# Altium project EV75E52A_R3.PrjPcb (part 2 of 4)
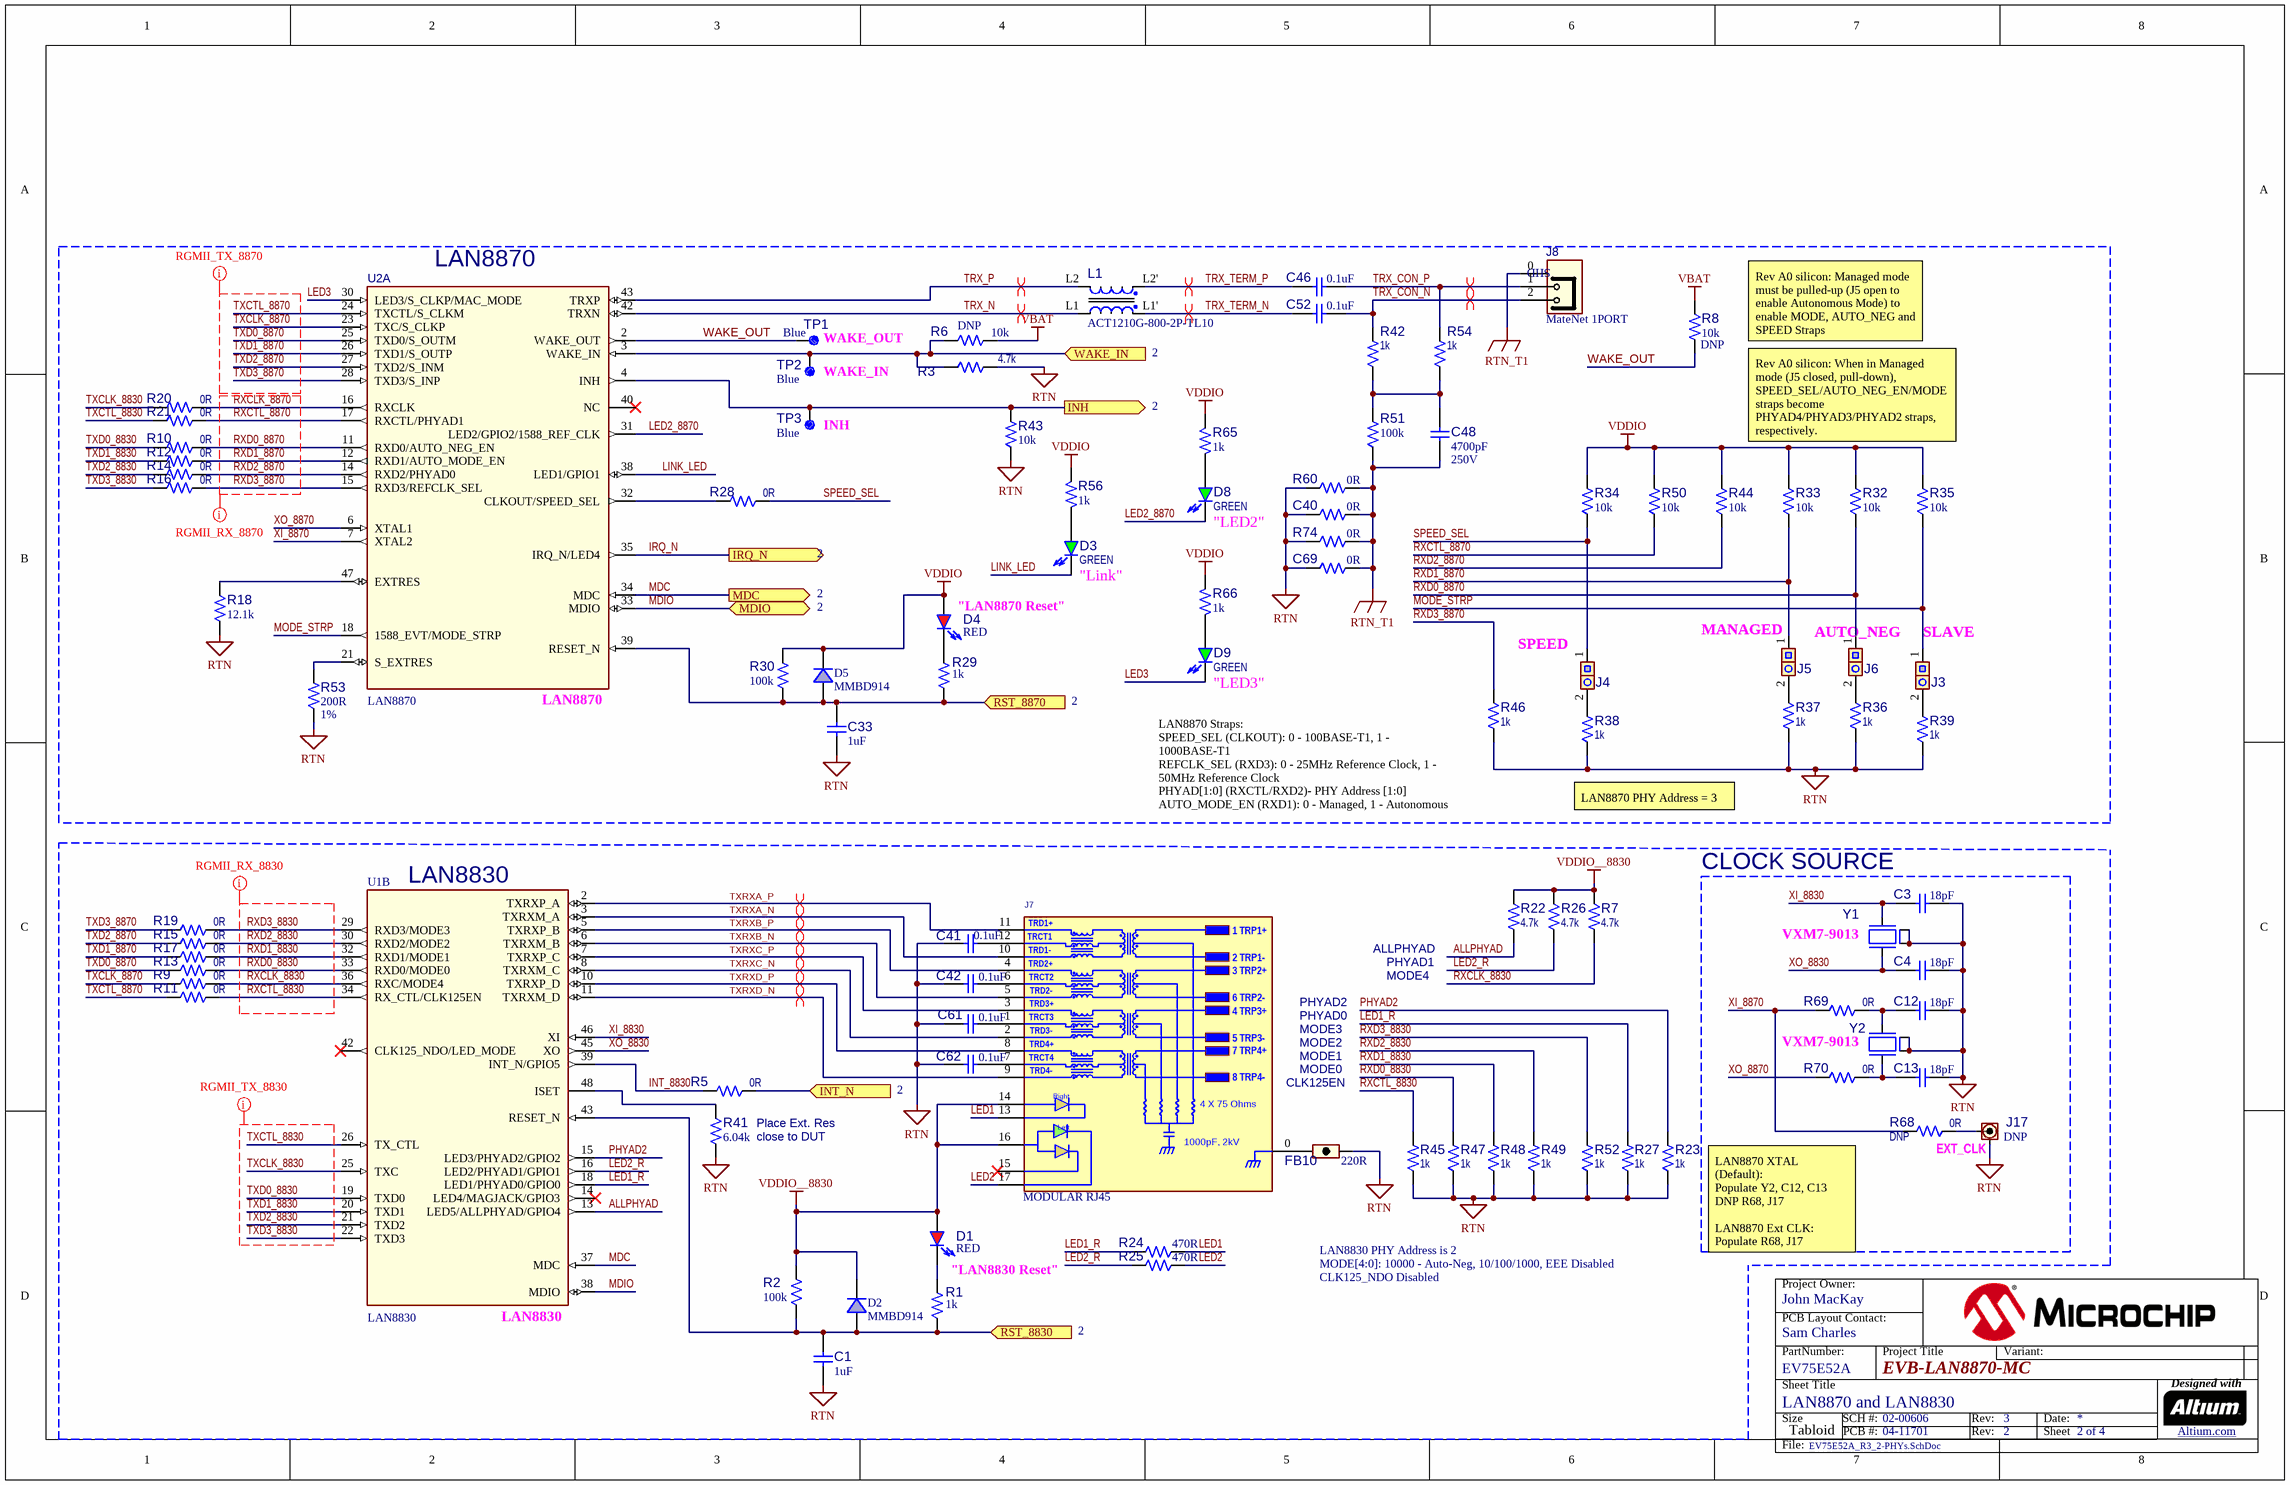
[diagram p4: EV75E52A_R3_2-PHYs.SchDoc]

## Sheet EV75E52A_R3_2-PHYs.SchDoc: LAN8870 and KSZ9131 (continued)

### Library data of the parts
C1 C33 = CAP0265: Capacitor; Manufacturer 1: AVX; Manufacturer Part Number 1: 0603YD105KAT2A; Voltage: 16V; Description_: CAP CER 1uF 16V 10% X5R SMD 0603; Dev Tools Status: Production; Tolerance: 10%; Temperature Coeffcient: X5R; Type: Ceramic; Populated: Yes; MCHP-ID: CAP0265; Value: 1uF; Package: 0603; Revision: 1; Symbol: Capacitor NP; Status: MCL Design; ComponentLink1URL: https://chn-vm-apps.microchip.com/mchprepo/parts/Datasheets/smccp.pdf; ComponentLink1Description: Datasheet; Operating Temperature: -55C to +85C; Category: Capacitor; Manufacturer 2: Murata; Manufacturer Part Number 2: GRM188R61C105KA93D; Manufacturer 3: Murata; Manufacturer Part Number 3: GRM185R61C105KE44D; Manufacturer 4: Panasonic; Manufacturer Part Number 4: ECJ-1VB1C105K; Manufacturer 5: TDK; Manufacturer Part Number 5: C1608X5R1C105K; Manufacturer 6: Taiyo Yuden; Manufacturer Part Number 6: EMK107BJ105KA-T; Supplier 1: Digi-Key; Supplier Part Number 1: 478-1249-1-ND; Supplier 2: Digi-Key; Supplier Part Number 2: 490-1536-1-ND; Supplier 3: Digi-Key; Supplier Part Number 3: 490-3894-1-ND; Supplier 4: Digi-Key; Supplier Part Number 4: PCC2224CT-ND; Supplier 5: Digi-Key; Supplier Part Number 5: 445-1416-1-ND; Supplier 6: Digi-Key; Supplier Part Number 6: 587-1251-1-ND; Quantity Override: 1
C3 C4 C12 C13 = CAP1091: Capacitor; Manufacturer 1: Murata; Manufacturer Part Number 1: GRM1555C1H180JA01D; Voltage: 50V; Description_: CAP CER 18pF 50V 5% C0G SMD 0402; Dev Tools Status: Production; Tolerance: 5%; Temperature Coeffcient: C0G; Type: Ceramic; Owner: Tad Ahlvers; Populated: YES; MCHP-ID: CAP1091; Package: 0402; Revision: 2; Symbol: Capacitor NP; Status: MCL Design; ComponentLink1URL: https://chn-vm-apps.microchip.com/mchprepo/parts/Datasheets/c02e.pdf; ComponentLink1Description: SVN Datasheet; ComponentLink2URL: C:\ALTIUM_WORK\00001_MCHP-CDB\Datasheets\c02e.pdf; ComponentLink2Description: Local Datasheet; ComponentLink3URL: C:\ALTIUM_WORK\00001_MCHP-CDB\Library\LibraryRefs\Capacitor NP.SchLib; ComponentLink3Description: Open Symbol; ComponentLink4URL: C:\ALTIUM_WORK\00001_MCHP-CDB\Library\Footprints\CAP_C_0402.PcbLib; ComponentLink4Description: Open Footprint; ComponentLink5Description: Open Footprint 2; ComponentLink6Description: Open Footprint 3; ComponentLink7Description: Open Footprint 4; Operating Temperature: -55C to +125C; Category: Capacitor; Manufacturer 2: Murata; Manufacturer Part Number 2: GRM1555C1H180JZ01; Supplier 1: Digi-Key; Supplier Part Number 1: 490-5858-1-ND; Supplier 2: Murata; Supplier Part Number 2: GRM1555C1H180JZ01; Quantity Override: 1
C40 C69 = RES2360: Manufacturer 1: Panasonic Electronic Components; Manufacturer Part Number 1: ERJ-3GEY0R00V; Description_: RES TKF 0R 1/10W SMD 0603 AEC-Q200; Dev Tools Status: Production; Type: RES SMD; Circuit Type: Isolated; Power: 1/10W; Owner: Steve Dziaba; Populated: YES; Restricted Sourcing: No; MCHP-ID: RES2360; Package: 0603; Revision: 1; Symbol: Resistor; Status: MCL Design; ComponentLink1URL: https://chn-vm-apps.microchip.com/mchprepo/parts/Datasheets/ERJ-3GEY0R00V.pdf; ComponentLink1Description: SVN Datasheet; ComponentLink2URL: C:\ALTIUM_WORK\00001_MCHP-CDB\Datasheets\ERJ-3GEY0R00V.pdf; ComponentLink2Description: Local Datasheet; ComponentLink3URL: C:\ALTIUM_WORK\00001_MCHP-CDB\Library\LibraryRefs\Resistor.SchLib; ComponentLink3Description: Open Symbol; ComponentLink4URL: C:\ALTIUM_WORK\00001_MCHP-CDB\Library\Footprints\RES_C_0603.PcbLib; ComponentLink4Description: Open Footprint; ComponentLink5Description: Open Footprint 2; ComponentLink6Description: Open Footprint 3; ComponentLink7Description: Open Footprint 4; Category: Resistor; Composition: TKF; Manufacturer 2: Vishay; Manufacturer Part Number 2: CRCW06030000Z0EB; Supplier 1: Digi-Key; Supplier Part Number 1: P0.0GCT-ND; Supplier 2: Digi-Key; Supplier Part Number 2: 541-2968-1-ND; Quantity Override: 1
C41 C42 C61 C62 = CAP1463: Capacitor; Manufacturer 1: TDK Corporation; Manufacturer Part Number 1: C1005X7R1H104K050BB; Tolerance: 10%; Description_: CAP CER 0.1uF 50V 10% X7R SMD 0402; Dev Tools Status: Production; Temperature Coeffcient: X7R; Type: Ceramic; Owner: Jamus Griego; Populated: YES; Voltage: 50V; Revision: 1; ComponentLink1URL: https://chn-vm-apps.microchip.com/mchprepo/parts/Datasheets/TDKMLCCCapRange.pdf; ComponentLink1Description: Datasheets; Operating Temperature: -55C to +125C; Category: Capacitor; Supplier 1: Digi-Key; Supplier Part Number 1: 445-5932-1-ND; MCHP-ID: CAP1463; Status: MCL Design; Quantity Override: 1; Package: 0402; Symbol: Capacitor NP
C46 C52 = CAP1682: Capacitor; Manufacturer 1: TDK Corporation; Manufacturer Part Number 1: C2012X7T2E104K125AA; Voltage: 250V; Description_: CAP CER 0.1uF 250V 10% X7T SMD 0805; Dev Tools Status: Design; Tolerance: 10%; Temperature Coeffcient: X7T; Type: Ceramic; Owner: Cristian Papuc; Populated: Yes; MCHP-ID: CAP1682; Package: 0805; Revision: A; Symbol: Capacitor NP; Status: MCL Design; ComponentLink1URL: https://chn-vm-apps.microchip.com/mchprepo/parts/Datasheets/mlcc_commercial_midvoltage_en.pdf; ComponentLink1Description: SVN Datasheet; ComponentLink2URL: C:\ALTIUM_WORK\00001_MCHP-CDB\Datasheets\mlcc_commercial_midvoltage_en.pdf; ComponentLink2Description: Local Datasheet; ComponentLink3URL: C:\ALTIUM_WORK\00001_MCHP-CDB\Library\LibraryRefs\Capacitor NP.SchLib; ComponentLink3Description: Open Symbol; ComponentLink4URL: C:\ALTIUM_WORK\00001_MCHP-CDB\Library\Footprints\CAP_C_0805.PcbLib; ComponentLink4Description: Open Footprint; ComponentLink5Description: Open Footprint 2; ComponentLink6Description: Open Footprint 3; ComponentLink7Description: Open Footprint 4; Operating Temperature: -55C to +125C; Category: Capacitor; Quantity Override: 1; Supplier 1: Digi-Key; Supplier Part Number 1: 445-C2012X7T2E104K125AACT-ND
C48 = CAP1956: Manufacturer 1: KEMET; Manufacturer Part Number 1: C0805C472KARACAUTO; Description_: CAP CER 4700pF 250V 10% X7R SMD 0805; Dev Tools Status: Production; Tolerance: 10%; Temperature Coefficient: X7R; Type: Ceramic; Owner: Darius Rydahl; Populated: YES; MCHP-ID: CAP1956; Revision: 1; Symbol: Capacitor NP; Status: MCL Design; ComponentLink1URL: https://chn-vm-apps.microchip.com/mchprepo/parts/Datasheets/2571446.pdf; ComponentLink1Description: SVN Datasheet; ComponentLink2URL: C:\ALTIUM_WORK\00001_MCHP-CDB\Datasheets\2571446.pdf; ComponentLink2Description: Local Datasheet; ComponentLink3URL: C:\ALTIUM_WORK\00001_MCHP-CDB\Library\LibraryRefs\Capacitor NP.SchLib; ComponentLink3Description: Open Symbol; ComponentLink4URL: C:\ALTIUM_WORK\00001_MCHP-CDB\Library\Footprints\CAP_C_0805.PcbLib; ComponentLink4Description: Open Footprint; ComponentLink5Description: Open Footprint 2; ComponentLink6Description: Open Footprint 3; ComponentLink7Description: Open Footprint 4; Operating Temperature: -40C to +125C; Category: Capacitor; Quantity Override: 1; Supplier 1: Digi-Key; Supplier Part Number 1: 399-16658-1-ND
D1 D4 = LED1073: LED; Manufacturer 1: Lite-On Inc.; Manufacturer Part Number 1: LTST-C191KRKT; Description_: DIO RED 2V 20mA 54mcd CLEAR SMD 0603; Dev Tools Status: Production; Type: LED Single; Forward Current: 20mA; Owner: Sompoch Loboonlert; Populated: YES; MCHP-ID: LED1073; Revision: 2; Symbol: LED_RED; Status: MCL Design; Package: 0603; ComponentLink1URL: https://chn-vm-apps.microchip.com/mchprepo/parts/Datasheets/LTST-C191KRKT.PDF; ComponentLink1Description: SVN Datasheet; ComponentLink2URL: C:\ALTIUM_WORK\00001_MCHP-CDB\Datasheets\LTST-C191KRKT.PDF; ComponentLink2Description: Local Datasheet; ComponentLink3URL: C:\ALTIUM_WORK\00001_MCHP-CDB\Library\LibraryRefs\LED_RED.SchLib; ComponentLink3Description: Open Symbol; ComponentLink4URL: C:\ALTIUM_WORK\00001_MCHP-CDB\Library\Footprints\LED_0603_RED.PcbLib; ComponentLink4Description: Open Footprint; ComponentLink5Description: Open Footprint 2; ComponentLink6Description: Open Footprint 3; ComponentLink7Description: Open Footprint 4; Category: Diode; Supplier 1: Digi-Key; Supplier Part Number 1: 160-1447-1-ND; Quantity Override: 1
D2 D5 = DIODE1281: Manufacturer 1: ON Semiconductor; Manufacturer Part Number 1: MMBD914LT1G; Description_: DIO RECT MMBD914LT1G 1V 10mA 100V SMD SOT-23-3; Dev Tools Status: Design; Type: Rectifier Single; Forward Current: 10mA; Power: 10mW; Reverse Current: 5uA; Reverse Recovery Time: 4ns; Reverse Voltage: 100V; Owner: Sam Charles; Populated: YES; MCHP-ID: DIODE1281; Value: MMBD914; Revision: B; Symbol: DIODE SINGLE sot-23-3; Status: MCL Design; Package: SOT-23-3; ComponentLink1URL: https://chn-vm-apps.microchip.com/mchprepo/parts/Datasheets/MMBD914LT1-D.PDF; ComponentLink1Description: datasheet; Operating Temperature: -55°C ~ 150°C; Category: Diode; Supplier 1: Digi-Key; Supplier Part Number 1: MMBD914LT1GOSCT-ND; Quantity Override: 1
D3 D8 D9 = DIODE1155: LED; Manufacturer 1: Lite-On Inc; Manufacturer Part Number 1: LTST-C191KGKT; Description_: DIO LED GREEN 2V 30mA 35mcd Clear SMD 0603; Dev Tools Status: Production; Type: LED Single; Forward Current: 30mA; Power: 75mW; Reverse Voltage: 5V; Owner: Tad Ahlvers; Populated: YES; MCHP-ID: DIODE1155; Revision: 1; Symbol: LED_green; Status: MCL Design; ComponentLink1URL: https://chn-vm-apps.microchip.com/mchprepo/parts/Datasheets/S_110_LTST-C191KGKT.pdf; ComponentLink1Description: SVN Datasheet; ComponentLink2URL: C:\ALTIUM_WORK\00001_MCHP-CDB\Datasheets\S_110_LTST-C191KGKT.pdf; ComponentLink2Description: Local Datasheet; ComponentLink3URL: C:\ALTIUM_WORK\00001_MCHP-CDB\Library\LibraryRefs\LED_green.SchLib; ComponentLink3Description: Open Symbol; ComponentLink4URL: C:\ALTIUM_WORK\00001_MCHP-CDB\Library\Footprints\LED_0603_GREEN.PcbLib; ComponentLink4Description: Open Footprint; ComponentLink5Description: Open Footprint 2; ComponentLink6Description: Open Footprint 3; ComponentLink7Description: Open Footprint 4; Operating Temperature: -55C to +85C; Category: Diode; Manufacturer 2: Ledtech; Manufacturer Part Number 2: LT8A23-54-SB96-T5; Supplier 1: Digi-Key; Supplier Part Number 1: 160-1446-1-ND; Supplier 2: Raynen; Supplier Part Number 2: LEDD00036B01; Quantity Override: 1
FB10 = IND1312: FERRITE 180R 1.5A SMD 0603; Manufacturer 1: Murata Electronics North America; Manufacturer Part Number 1: BLM18EG221SN1D; Description_: FERRITE 220R@100MHZ 2A SMD 0603; Dev Tools Status: Design; Owner: Sam Charles; DCR: 0.050R; Test Frequency: 100Mhz; Populated: Yes; MCHP-ID: IND1312; Revision: A; Symbol: Ferrite Bead; Status: MCL Design; ComponentLink1URL: https://chn-vm-apps.microchip.com/mchprepo/parts/Datasheets/L0110S0101BLM18E.pdf; ComponentLink1Description: SVN Datasheet; ComponentLink2URL: C:\ALTIUM_WORK\00001_MCHP-CDB\Datasheets\L0110S0101BLM18E.pdf; ComponentLink2Description: Local Datasheet; ComponentLink3URL: C:\ALTIUM_WORK\00001_MCHP-CDB\Library\LibraryRefs\Ferrite Bead.SchLib; ComponentLink3Description: Open Symbol; ComponentLink4URL: C:\ALTIUM_WORK\00001_MCHP-CDB\Library\Footprints\IND_C_0603.PcbLib; ComponentLink4Description: Open Footprint; ComponentLink5Description: Open Footprint 2; ComponentLink6Description: Open Footprint 3; ComponentLink7Description: Open Footprint 4; Operating Temperature: -55°C ~ 125°C; Package: 0603; Type: Ferrite Bead; Category: Inductor; Manufacturer 2: MOUSER ELECTRONICS; Manufacturer Part Number 2: 81-BLM18EG221SN1D; Quantity Override: 1; Supplier 1: Mouser; Supplier Part Number 1: 81-BLM18EG221SN1D
J3-J6 = CON1108: Manufacturer 1: FCI; Manufacturer Part Number 1: 77311-118-02LF; Description_: CON HDR-2.54 Male 1x2 Gold 5.84MH TH VERT; Dev Tools Status: Production; Owner: Bogdan P (M91398); Populated: Yes; MCHP-ID: CON1108; Revision: 1; Symbol: Header 1x2; Status: MCL Design; ComponentLink1URL: https://chn-vm-apps.microchip.com/mchprepo/parts/Datasheets/77311.pdf; ComponentLink1Description: SVN Datasheet; ComponentLink2URL: C:\ALTIUM_WORK\00001_MCHP-CDB\Datasheets\77311.pdf; ComponentLink2Description: Local Datasheet; ComponentLink3URL: C:\ALTIUM_WORK\00001_MCHP-CDB\Library\LibraryRefs\Header 1x2.SchLib; ComponentLink3Description: Open Symbol; ComponentLink4URL: C:\ALTIUM_WORK\00001_MCHP-CDB\Library\Footprints\HDR_M_2.54_1x2.PcbLib; ComponentLink4Description: Open Footprint; ComponentLink5Description: Open Footprint 2; ComponentLink6Description: Open Footprint 3; ComponentLink7Description: Open Footprint 4; Type: Header 2.54mm; Category: Connector; Manufacturer 2: FCI; Manufacturer Part Number 2: 68001-202HLF; Manufacturer 3: FCI; Manufacturer Part Number 3: 68000-202HLF; Manufacturer 4: Samtec; Manufacturer Part Number 4: TSW-102-07-G-S; Manufacturer 5: Sullins; Manufacturer Part Number 5: PBC02SAAN; Manufacturer 6: SPC Technology; Manufacturer Part Number 6: SPC20481; Manufacturer 7: Samtec; Manufacturer Part Number 7: TSW-102-07-F-S; Manufacturer 8: Nextron; Manufacturer Part Number 8: R-211-0211-0021-000; Manufacturer 9: Samtec; Manufacturer Part Number 9: TSW-102-07-S-S; Supplier 1: Digi-Key; Supplier Part Number 1: 609-4434-ND; Supplier 2: Digi-Key; Supplier Part Number 2: 609-3469-ND; Supplier 3: Digi-Key; Supplier Part Number 3: 609-3502-ND; Supplier 4: Digi-Key; Supplier Part Number 4: SAM1029-02-ND; Supplier 5: Digi-Key; Supplier Part Number 5: S1011E-02-ND; Supplier 6: Newark; Supplier Part Number 6: 93K5734; Supplier 7: Newark; Supplier Part Number 7: 79P3146; Supplier 8: Raynen; Supplier Part Number 8: R-211-0211-0021-000; Supplier 9: Samtec; Supplier Part Number 9: TSW-102-07-S-S; Quantity Override: 1
J7 = CON2551: Manufacturer 1: Bel Fuse; Description_: CON MODULAR JACK RJ45 10/100/1000 MAGNETICS 2xLEDs SHIELD TH; Dev Tools Status: Design; Owner: Sam Charles; Populated: YES; Revision: 1; ComponentLink5Description: Open Footprint 2; ComponentLink6Description: Open Footprint 3; ComponentLink7Description: Open Footprint 4; MCHP-ID: CON2551; Symbol: CON_RJ-45_L829-1J1T-43; Status: MCL Design; ComponentLink1URL: https://chn-vm-apps.microchip.com/mchprepo/parts/Datasheets/dr-MAG-L829-1J1T-43.pdf; ComponentLink1Description: SVN Datasheet; ComponentLink2URL: C:\ALTIUM_WORK\00001_MCHP-CDB\Datasheets\dr-MAG-L829-1J1T-43.pdf; ComponentLink2Description: Local Datasheet; ComponentLink3URL: C:\ALTIUM_WORK\00001_MCHP-CDB\Library\LibraryRefs\CON_RJ-45_L829-1J1T-43.SchLib; ComponentLink3Description: Open Symbol; ComponentLink4URL: C:\ALTIUM_WORK\00001_MCHP-CDB\Library\Footprints\CON_JACK_RJ45_L829-1J1T-43.PcbLib; ComponentLink4Description: Open Footprint; Type: Modular; Category: Connector; Manufacturer Part Number 1: L829-1J1T-43; Supplier 1: Digi-Key; Supplier Part Number 1: 380-1110-ND; Quantity Override: 1; Operating Temperature: 0°C ~ 70°C; Assembly Type: TH
J8 = CON2446: Manufacturer 1: TE Connectivity; Manufacturer Part Number 1: 9-2304372-9; Description_: CON HDR-1.8 MALE 1X2 TIN SHROUD 7MH TH R/A; Dev Tools Status: Design; Owner: Sam Charles; Populated: YES; Restricted Sourcing: No; MCHP-ID: CON2446; Revision: 2; Symbol: 3PIN_WSHD; Status: MCL Design; ComponentLink1URL: https://chn-vm-apps.microchip.com/mchprepo/parts/Datasheets/2304372_A5-2256541.pdf; ComponentLink1Description: SVN Datasheet; ComponentLink2URL: C:\ALTIUM_WORK\00001_MCHP-CDB\Datasheets\2304372_A5-2256541.pdf; ComponentLink2Description: Local Datasheet; ComponentLink3URL: C:\ALTIUM_WORK\00001_MCHP-CDB\Library\LibraryRefs\3PIN_WSHD.SchLib; ComponentLink3Description: Open Symbol; ComponentLink4URL: C:\ALTIUM_WORK\00001_MCHP-CDB\Library\Footprints\CON_2304372-9.PcbLib; ComponentLink4Description: Open Footprint; ComponentLink5Description: Open Footprint 2; ComponentLink6Description: Open Footprint 3; ComponentLink7Description: Open Footprint 4; Type: Header; Category: Connector; Supplier 1: Mouser; Supplier Part Number 1: 571-9-2304372-9; Quantity Override: 1; Operating Temperature: .-40°C to +105°C; Assembly Type: TH
J17 = CON1680: CON Jack 2 Pins; Manufacturer 1: Cinch Connectivity Solutions Johnson; Manufacturer Part Number 1: 135-3701-211; Description_: CON RF Coaxial MMCX Female 2P TH VERT; Dev Tools Status: Design; Owner: Sam Charles; MCHP-ID: CON1680; Value: RF MMCX Female; Revision: B; Symbol: CON Jack 2 Pins; Status: MCL Design; ComponentLink1URL: https://chn-vm-apps.microchip.com/mchprepo/parts/Datasheets/pi-135-3701-211.pdf; ComponentLink1Description: SVN Datasheet; ComponentLink2URL: C:\ALTIUM_WORK\00001_MCHP-CDB\Datasheets\pi-135-3701-211.pdf; ComponentLink2Description: Local Datasheet; ComponentLink3URL: C:\ALTIUM_WORK\00001_MCHP-CDB\Library\LibraryRefs\CON Jack 2 Pins.SchLib; ComponentLink3Description: Open Symbol; ComponentLink4URL: C:\ALTIUM_WORK\00001_MCHP-CDB\Library\Footprints\CON_MMCX_CINCH_135-3701-211.PcbLib; ComponentLink4Description: Open Footprint; ComponentLink5Description: Open Footprint 2; ComponentLink6Description: Open Footprint 3; ComponentLink7Description: Open Footprint 4; Type: RF; Category: Connector; Supplier 1: Digi-Key; Supplier Part Number 1: J598-ND; Quantity Override: 1
L1 = IND1916: Inductor; Manufacturer 1: TDK Corporation; Value: CM CHOKE 80uH; Description_: CM CHOKE 2.4R@100kHZ 80uH SMD 3.2X2.5MM AEC-Q200; Dev Tools Status: Design; Type: CM Choke; Owner: Sam Charles; DCR: 2.4R; Saturation Current: 70mA; Test Frequency: 100kHZ; Populated: YES; MCHP-ID: IND1916; Revision: 1; Symbol: Inductor Choke; Status: MCL Design; ComponentLink1URL: https://chn-vm-apps.microchip.com/mchprepo/parts/Datasheets/ACT1210G_Type_DS.pdf; ComponentLink1Description: SVN Datasheet; ComponentLink2URL: C:\ALTIUM_WORK\00001_MCHP-CDB\Datasheets\ACT1210G_Type_DS.pdf; ComponentLink2Description: Local Datasheet; ComponentLink3URL: C:\ALTIUM_WORK\00001_MCHP-CDB\Library\LibraryRefs\Inductor Choke.SchLib; ComponentLink3Description: Open Symbol; ComponentLink4URL: C:\ALTIUM_WORK\00001_MCHP-CDB\Library\Footprints\IND_TDK_ACT1210L-201-2P_L3.9W2.5H2.5.PcbLib; ComponentLink4Description: Open Footprint; ComponentLink5Description: Open Footprint 2; ComponentLink6Description: Open Footprint 3; ComponentLink7Description: Open Footprint 4; Operating Temperature: -40°C ~ 125°C; Package: 4 PC SMD; Category: Inductor; Supplier 1: Digi-Key; Supplier Part Number 1: 445-ACT1210G-800-2P-TL10CT-ND; Quantity Override: 1
R1 R29 = RES1128: Resistor; Manufacturer 1: Panasonic; Manufacturer Part Number 1: ERJ-3GEYJ102V; Tolerance: 5%; Description_: RES TKF 1k 5% 1/10W SMD 0603; Dev Tools Status: Production; Voltage: 75V; Temperature Coeffcient: 200ppm/C; Power: 1/10W; Owner: Bogdan P (M91398); Populated: Yes; MCHP-ID: RES1128; Value: 1k; Package: 0603; Revision: 0; Symbol: Resistor; Status: MCL Design; ComponentLink1URL: https://chn-vm-apps.microchip.com/mchprepo/parts/Datasheets/AOA0000CE1.pdf; ComponentLink1Description: SVN Datasheet; ComponentLink2URL: C:\ALTIUM_WORK\00001_MCHP-CDB\Datasheets\AOA0000CE1.pdf; ComponentLink2Description: Local Datasheet; ComponentLink3URL: C:\ALTIUM_WORK\00001_MCHP-CDB\Library\LibraryRefs\Resistor.SchLib; ComponentLink3Description: Open Symbol; ComponentLink4URL: C:\ALTIUM_WORK\00001_MCHP-CDB\Library\Footprints\RES_C_0603.PcbLib; ComponentLink4Description: Open Footprint; ComponentLink5Description: Open Footprint 2; ComponentLink6Description: Open Footprint 3; ComponentLink7Description: Open Footprint 4; Operating Temperature: -55C to +155C; Category: Resistor; Type: RES SMD; Composition: TKF; Supplier 1: Digi-Key; Supplier Part Number 1: P1.0KGCT-ND; Quantity Override: 1
R2 R30 = RSMT0215: Resistor; Manufacturer 1: Stackpole Electronics Inc; Manufacturer Part Number 1: RMCF0603FT100K; Tolerance: 1%; Description_: RES TKF 100k 1% 1/10W SMD 0603; Dev Tools Status: Production; Voltage: 75V; Temperature Coeffcient: 100ppm/C; Power: 1/10W; Populated: Yes; MCHP-ID: RSMT0215; Value: 100k; Package: 0603; Revision: 1; Symbol: Resistor; Status: MCL Design; ComponentLink1URL: https://chn-vm-apps.microchip.com/mchprepo/parts/Datasheets/AOA0000CE2.pdf; ComponentLink1Description: Datasheet; Operating Temperature: -55C to +155C; Category: Resistor; Type: RES SMD; Composition: TKF; Manufacturer 2: Panasonic; Manufacturer Part Number 2: ERJ-3EKF1003V; Manufacturer 3: Rohm Semiconductor; Manufacturer Part Number 3: MCR03EZPFX1003; Manufacturer 4: TE Connectivity; Manufacturer Part Number 4: 1622827-1; Supplier 3: Digi-Key; Supplier Part Number 3: P100KHTR-ND; Supplier 2: Digi-Key; Supplier Part Number 2: P100KHCT-ND; Supplier 1: Digi-Key; Supplier Part Number 1: RMCF0603FT100KCT-ND; Supplier 4: Digi-Key; Supplier Part Number 4: RMCF1/16100KFRTR-ND; Supplier 5: Digi-Key; Supplier Part Number 5: RHM100KHCT-ND; Supplier 6: Digi-Key; Supplier Part Number 6: A106046CT-ND; Quantity Override: 1
R3 R7 = RES1813: Manufacturer 1: Yageo; Manufacturer Part Number 1: RC0402FR-074K7L; Tolerance: 1%; Description_: RES TKF 4.7k 1% 1/16W SMD 0402; Dev Tools Status: Production; Temperature Coeffcient: 100ppm/C; Circuit Type: Isolated; Power: 1/16W; Owner: Mike Ragsdale; Populated: Yes; MCHP-ID: RES1813; Package: 0402; Revision: 1; Symbol: resistor; Status: MCL Design; ComponentLink1URL: https://chn-vm-apps.microchip.com/mchprepo/parts/Datasheets/PYu-RC_Group_51_RoHS_L_8.pdf; ComponentLink1Description: SVN Datasheet; ComponentLink2URL: C:\ALTIUM_WORK\00001_MCHP-CDB\Datasheets\PYu-RC_Group_51_RoHS_L_8.pdf; ComponentLink2Description: Local Datasheet; ComponentLink3URL: C:\ALTIUM_WORK\00001_MCHP-CDB\Library\LibraryRefs\resistor.SchLib; ComponentLink3Description: Open Symbol; ComponentLink4URL: C:\ALTIUM_WORK\00001_MCHP-CDB\Library\Footprints\RES_C_0402.PcbLib; ComponentLink4Description: Open Footprint; ComponentLink5Description: Open Footprint 2; ComponentLink6Description: Open Footprint 3; ComponentLink7Description: Open Footprint 4; Operating Temperature: -55C to +155C; Category: Resistor; Type: RES SMD; Supplier 1: Digi-Key; Supplier Part Number 1: 311-4.7KLRTR-ND; Supplier 2: Digi-Key; Supplier Part Number 2: 311-4.7KLRCT-ND; Quantity Override: 1
R5 R9-R17 R19-R21 R28 R69 R70 = RSMT1040: Manufacturer 1: Yageo; Manufacturer Part Number 1: RC0402JR-070RL; Description_: RES TKF 0R 1/16W SMD 0402; Dev Tools Status: Production; Power: 1/16W; Owner: Sompoch Loboonlert; Populated: Yes; MCHP-ID: RSMT1040; Revision: 2; Symbol: Resistor; Status: MCL Design; ComponentLink1URL: https://chn-vm-apps.microchip.com/mchprepo/parts/Datasheets/PYu-RC0402_51_RoHS_L_6.pdf; ComponentLink1Description: SVN Datasheet; ComponentLink2URL: C:\ALTIUM_WORK\00001_MCHP-CDB\Datasheets\PYu-RC0402_51_RoHS_L_6.pdf; ComponentLink2Description: Local Datasheet; ComponentLink3URL: C:\ALTIUM_WORK\00001_MCHP-CDB\Library\LibraryRefs\Resistor.SchLib; ComponentLink3Description: Open Symbol; ComponentLink4URL: C:\ALTIUM_WORK\00001_MCHP-CDB\Library\Footprints\RES_C_0402.PcbLib; ComponentLink4Description: Open Footprint; ComponentLink5Description: Open Footprint 2; ComponentLink6Description: Open Footprint 3; ComponentLink7Description: Open Footprint 4; Operating Temperature: -55C to +155C; Category: Resistor; Type: RES SMD; Composition: TKF; Supplier 1: Digi-Key; Supplier Part Number 1: 311-0.0JRCT-ND; Quantity Override: 1
R6 R8 = RES2543: Manufacturer 1: TE Connectivity Passive Product; Manufacturer Part Number 1: CRG0402F10K; Tolerance: 1%; Description_: RES TKF 10k 1% 1/16W SMD 0402; Dev Tools Status: Production; Voltage: 50V; Temperature Coefficient: 100ppm/C; Power: 1/16W; Owner: Jose Garcia; MCHP-ID: RES2543; Package: 0402; Revision: 1; Symbol: Resistor; Status: MCL Design; ComponentLink1URL: https://chn-vm-apps.microchip.com/mchprepo/parts/Datasheets/ENG_DS_1773204_J.pdf; ComponentLink1Description: SVN Datasheet; ComponentLink2URL: C:\ALTIUM_WORK\00001_MCHP-CDB\Datasheets\ENG_DS_1773204_J.pdf; ComponentLink2Description: Local Datasheet; ComponentLink3URL: C:\ALTIUM_WORK\00001_MCHP-CDB\Library\LibraryRefs\Resistor.SchLib; ComponentLink3Description: Open Symbol; ComponentLink4URL: C:\ALTIUM_WORK\00001_MCHP-CDB\Library\Footprints\RES_C_0402.PcbLib; ComponentLink4Description: Open Footprint; ComponentLink5Description: Open Footprint 2; ComponentLink6Description: Open Footprint 3; ComponentLink7Description: Open Footprint 4; Operating Temperature: -55C to 155C; Category: Resistor; Type: RES SMD; Composition: TKF; Supplier 1: Digi-Key; Supplier Part Number 1: A121528CT-ND; Quantity Override: 1
R18 = RES1490: Manufacturer 1: Vishay; Manufacturer Part Number 1: CRCW040212K1FKEDC; Tolerance: 1%; Description_: RES TKF 12.1k 1% 1/16W SMD 0402; Dev Tools Status: Production; Voltage: 50V; Power: 1/16W; Owner: Mike Ragsdale; Populated: YES; MCHP-ID: RES1490; Package: 0402; Revision: 2; Symbol: Resistor; Status: MCL Design; ComponentLink1URL: https://chn-vm-apps.microchip.com/mchprepo/parts/Datasheets/mcr_g.pdf; ComponentLink1Description: SVN Datasheet; ComponentLink2URL: C:\ALTIUM_WORK\00001_MCHP-CDB\Datasheets\mcr_g.pdf; ComponentLink2Description: Local Datasheet; ComponentLink3URL: C:\ALTIUM_WORK\00001_MCHP-CDB\Library\LibraryRefs\Resistor.SchLib; ComponentLink3Description: Open Symbol; ComponentLink4URL: C:\ALTIUM_WORK\00001_MCHP-CDB\Library\Footprints\RES_C_0402.PcbLib; ComponentLink4Description: Open Footprint; ComponentLink5Description: Open Footprint 2; ComponentLink6Description: Open Footprint 3; ComponentLink7Description: Open Footprint 4; Operating Temperature: -55C to +155C; Category: Resistor; Type: RES SMD; Composition: TKF; Manufacturer 2: Yageo; Manufacturer Part Number 2: RC0402FR-0712K1L; Supplier 1: Digi-Key; Supplier Part Number 1: 541-4703-1-ND; Supplier 2: Digi-Key; Supplier Part Number 2: 311-12.1KLRCT-ND; Quantity Override: 1
R22 R26 = RES1813: Manufacturer 1: Yageo; Manufacturer Part Number 1: RC0402FR-074K7L; Tolerance: 1%; Description_: RES TKF 4.7k 1% 1/16W SMD 0402; Dev Tools Status: Production; Temperature Coeffcient: 100ppm/C; Circuit Type: Isolated; Power: 1/16W; Owner: Mike Ragsdale; Populated: YES; MCHP-ID: RES1813; Package: 0402; Revision: 1; Symbol: resistor; Status: MCL Design; ComponentLink1URL: https://chn-vm-apps.microchip.com/mchprepo/parts/Datasheets/PYu-RC_Group_51_RoHS_L_8.pdf; ComponentLink1Description: SVN Datasheet; ComponentLink2URL: C:\ALTIUM_WORK\00001_MCHP-CDB\Datasheets\PYu-RC_Group_51_RoHS_L_8.pdf; ComponentLink2Description: Local Datasheet; ComponentLink3URL: C:\ALTIUM_WORK\00001_MCHP-CDB\Library\LibraryRefs\resistor.SchLib; ComponentLink3Description: Open Symbol; ComponentLink4URL: C:\ALTIUM_WORK\00001_MCHP-CDB\Library\Footprints\RES_C_0402.PcbLib; ComponentLink4Description: Open Footprint; ComponentLink5Description: Open Footprint 2; ComponentLink6Description: Open Footprint 3; ComponentLink7Description: Open Footprint 4; Operating Temperature: -55C to +155C; Category: Resistor; Type: RES SMD; Supplier 1: Digi-Key; Supplier Part Number 1: 311-4.7KLRTR-ND; Supplier 2: Digi-Key; Supplier Part Number 2: 311-4.7KLRCT-ND; Quantity Override: 1
R23 R27 R36-R39 R45-R49 R52 = RES1663: Manufacturer 1: Yageo; Manufacturer Part Number 1: RT0402BRD071KL; Tolerance: 0.1%; Description_: RES TF 1k 0.1% 1/16W SMD 0402; Dev Tools Status: Design; Voltage: 50V; Temperature Coeffcient: 25ppm/C; Power: 1/16W; Owner: Jose Garcia; Populated: Yes; MCHP-ID: RES1663; Package: 0402; Revision: A; Symbol: Resistor; Status: MCL Design; ComponentLink1URL: https://chn-vm-apps.microchip.com/mchprepo/parts/Datasheets/PYu-RT_1-to-0.01_RoHS_L_8.pdf; ComponentLink1Description: SVN Datasheet; ComponentLink2URL: C:\ALTIUM_WORK\00001_MCHP-CDB\Datasheets\PYu-RT_1-to-0.01_RoHS_L_8.pdf; ComponentLink2Description: Local Datasheet; ComponentLink3URL: C:\ALTIUM_WORK\00001_MCHP-CDB\Library\LibraryRefs\Resistor.SchLib; ComponentLink3Description: Open Symbol; ComponentLink4URL: C:\ALTIUM_WORK\00001_MCHP-CDB\Library\Footprints\RES_C_0402.PcbLib; ComponentLink4Description: Open Footprint; ComponentLink5Description: Open Footprint 2; ComponentLink6Description: Open Footprint 3; ComponentLink7Description: Open Footprint 4; Operating Temperature: -55C to +155C; Category: Resistor; Type: RES SMD; Composition: TF; Supplier 1: Digi-Key; Supplier Part Number 1: YAG1386CT-ND; Quantity Override: 1
R24 R25 = RSMT0337: Manufacturer 1: Panasonic; Manufacturer Part Number 1: ERJ-2GEJ471X; Tolerance: 5%; Description_: RES TKF 470R 5% 1/16W SMD 0402; Dev Tools Status: Production; Voltage: 50V; Temperature Coefficient: 200ppm/C; Power: 1/16W; Populated: Yes; MCHP-ID: RSMT0337; Package: 0402; Revision: 1; Symbol: Resistor; Status: MCL Design; ComponentLink1URL: https://chn-vm-apps.microchip.com/mchprepo/parts/Datasheets/mcr_a.pdf; ComponentLink1Description: SVN Datasheet; ComponentLink2URL: C:\ALTIUM_WORK\00001_MCHP-CDB\Datasheets\mcr_a.pdf; ComponentLink2Description: Local Datasheet; ComponentLink3URL: C:\ALTIUM_WORK\00001_MCHP-CDB\Library\LibraryRefs\Resistor.SchLib; ComponentLink3Description: Open Symbol; ComponentLink4URL: C:\ALTIUM_WORK\00001_MCHP-CDB\Library\Footprints\RES_C_0402.PcbLib; ComponentLink4Description: Open Footprint; ComponentLink5Description: Open Footprint 2; ComponentLink6Description: Open Footprint 3; ComponentLink7Description: Open Footprint 4; Operating Temperature: -55C to +155C; Category: Resistor; Type: RES SMD; Composition: TKF; Manufacturer 2: ROHM; Manufacturer Part Number 2: MCR01MZPJ471; Supplier 1: Digi-Key; Supplier Part Number 1: P470JCT-ND; Supplier 2: Digi-Key; Supplier Part Number 2: RHM470JCT-ND; Quantity Override: 1
R32-R35 R43 R44 R50 = RES2543: Manufacturer 1: TE Connectivity Passive Product; Manufacturer Part Number 1: CRG0402F10K; Tolerance: 1%; Description_: RES TKF 10k 1% 1/16W SMD 0402; Dev Tools Status: Production; Voltage: 50V; Temperature Coefficient: 100ppm/C; Power: 1/16W; Owner: Jose Garcia; Populated: YES; MCHP-ID: RES2543; Package: 0402; Revision: 1; Symbol: Resistor; Status: MCL Design; ComponentLink1URL: https://chn-vm-apps.microchip.com/mchprepo/parts/Datasheets/ENG_DS_1773204_J.pdf; ComponentLink1Description: SVN Datasheet; ComponentLink2URL: C:\ALTIUM_WORK\00001_MCHP-CDB\Datasheets\ENG_DS_1773204_J.pdf; ComponentLink2Description: Local Datasheet; ComponentLink3URL: C:\ALTIUM_WORK\00001_MCHP-CDB\Library\LibraryRefs\Resistor.SchLib; ComponentLink3Description: Open Symbol; ComponentLink4URL: C:\ALTIUM_WORK\00001_MCHP-CDB\Library\Footprints\RES_C_0402.PcbLib; ComponentLink4Description: Open Footprint; ComponentLink5Description: Open Footprint 2; ComponentLink6Description: Open Footprint 3; ComponentLink7Description: Open Footprint 4; Operating Temperature: -55C to 155C; Category: Resistor; Type: RES SMD; Composition: TKF; Supplier 1: Digi-Key; Supplier Part Number 1: A121528CT-ND; Quantity Override: 1
R41 = RES1495: Manufacturer 1: Yageo; Manufacturer Part Number 1: RC0402FR-076K04L; Tolerance: 1%; Description_: RES TKF 6.04k 1% 1/16W SMD 0402; Dev Tools Status: Production; Voltage: 50V; Power: 1/16W; Owner: Severino Balong Jr.; Populated: YES; MCHP-ID: RES1495; Package: 0402; Revision: 2; Symbol: Resistor; Status: MCL Design; ComponentLink1URL: https://chn-vm-apps.microchip.com/mchprepo/parts/Datasheets/PYu-RC_Group_51_RoHS_L_11.pdf; ComponentLink1Description: SVN Datasheet; ComponentLink2URL: C:\ALTIUM_WORK\00001_MCHP-CDB\Datasheets\PYu-RC_Group_51_RoHS_L_11.pdf; ComponentLink2Description: Local Datasheet; ComponentLink3URL: C:\ALTIUM_WORK\00001_MCHP-CDB\Library\LibraryRefs\Resistor.SchLib; ComponentLink3Description: Open Symbol; ComponentLink4URL: C:\ALTIUM_WORK\00001_MCHP-CDB\Library\Footprints\RES_C_0402.PcbLib; ComponentLink4Description: Open Footprint; ComponentLink5Description: Open Footprint 2; ComponentLink6Description: Open Footprint 3; ComponentLink7Description: Open Footprint 4; Operating Temperature: -55C to +155C; Category: Resistor; Type: RES SMD; Composition: TKF; Supplier 1: Digi-Key; Supplier Part Number 1: YAG2293TR-ND; Quantity Override: 1
R42 R54 = RES1727: Manufacturer 1: Stackpole Electronics Inc.; Manufacturer Part Number 1: RNCP1206FTD1K00; Tolerance: 1%; Description_: RES TF 1k 1% 1/2W SMD 1206; Dev Tools Status: Design; Voltage: 200V; Temperature Coeffcient: 100ppm/C; Circuit Type: Isolated; Power: 1/2W; Owner: Mark Loper; Populated: Yes; MCHP-ID: RES1727; Package: 1206; Revision: A; Symbol: Resistor; Status: MCL Design; ComponentLink1URL: https://chn-vm-apps.microchip.com/mchprepo/parts/Datasheets/SEI-rncp.pdf; ComponentLink1Description: SVN Datasheet; ComponentLink2URL: C:\ALTIUM_WORK\00001_MCHP-CDB\Datasheets\SEI-rncp.pdf; ComponentLink2Description: Local Datasheet; ComponentLink3URL: C:\ALTIUM_WORK\00001_MCHP-CDB\Library\LibraryRefs\Resistor.SchLib; ComponentLink3Description: Open Symbol; ComponentLink4URL: C:\ALTIUM_WORK\00001_MCHP-CDB\Library\Footprints\RES_C_1206.PcbLib; ComponentLink4Description: Open Footprint; ComponentLink5Description: Open Footprint 2; ComponentLink6Description: Open Footprint 3; ComponentLink7Description: Open Footprint 4; Operating Temperature: -55C to +155C; Category: Resistor; Type: RES SMD; Composition: TF; Supplier 1: Digi-Key; Supplier Part Number 1: RNCP1206FTD1K00CT-ND; Quantity Override: 1
R51 = RSMT0714: Manufacturer 1: Vishay; Manufacturer Part Number 1: CRCW0603100KFKEAHP; Tolerance: 1%; Description_: RES TKF 100k 1% 1/4W SMD 0603; Dev Tools Status: Production; Voltage: 75V; Temperature Coeffcient: 100ppm/C; Power: 1/4W; Populated: Yes; MCHP-ID: RSMT0714; Package: 0603; Revision: 1; Symbol: Resistor; Status: MCL Design; ComponentLink1URL: https://chn-vm-apps.microchip.com/mchprepo/parts/Datasheets/dcrcwe3.pdf; ComponentLink1Description: SVN Datasheet; ComponentLink2URL: C:\ALTIUM_WORK\00001_MCHP-CDB\Datasheets\dcrcwe3.pdf; ComponentLink2Description: Local Datasheet; ComponentLink3URL: C:\ALTIUM_WORK\00001_MCHP-CDB\Library\LibraryRefs\Resistor.SchLib; ComponentLink3Description: Open Symbol; ComponentLink4URL: C:\ALTIUM_WORK\00001_MCHP-CDB\Library\Footprints\RES_C_0603.PcbLib; ComponentLink4Description: Open Footprint; ComponentLink5Description: Open Footprint 2; ComponentLink6Description: Open Footprint 3; ComponentLink7Description: Open Footprint 4; Operating Temperature: -55C to +155C; Category: Resistor; Type: RES SMD; Composition: TKF; Supplier 1: Digi-Key; Supplier Part Number 1: 541-100KSCT-ND; Quantity Override: 1
R53 = RES1496: Manufacturer 1: Panasonic; Manufacturer Part Number 1: ERJ-2RKF2000X; Description_: RES TKF 200R 1% 1/10W SMD 0402; Dev Tools Status: Production; Voltage: 50V; Temperature Coefficient: 200ppm/C; Power: 1/10W; Populated: YES; MCHP-ID: RES1496; Package: 0402; Revision: 1; Symbol: Resistor; Status: MCL Design; ComponentLink1URL: https://chn-vm-apps.microchip.com/mchprepo/parts/Datasheets/AOA0000CE1.pdf; ComponentLink1Description: SVN Datasheet; ComponentLink2URL: C:\ALTIUM_WORK\00001_MCHP-CDB\Datasheets\AOA0000CE1.pdf; ComponentLink2Description: Local Datasheet; ComponentLink3URL: C:\ALTIUM_WORK\00001_MCHP-CDB\Library\LibraryRefs\Resistor.SchLib; ComponentLink3Description: Open Symbol; ComponentLink4URL: C:\ALTIUM_WORK\00001_MCHP-CDB\Library\Footprints\RES_C_0402.PcbLib; ComponentLink4Description: Open Footprint; ComponentLink5Description: Open Footprint 2; ComponentLink6Description: Open Footprint 3; ComponentLink7Description: Open Footprint 4; Operating Temperature: -55C to +155C; Category: Resistor; Type: RES SMD; Composition: TKF; Supplier 1: Digi-Key; Supplier Part Number 1: P200LTR-ND; Quantity Override: 1
R56 R65 R66 = RSMT0138: Manufacturer 1: Panasonic; Manufacturer Part Number 1: ERJ-3EKF1001V; Tolerance: 1%; Description_: RES TKF 1k 1% 1/10W SMD 0603; Dev Tools Status: Production; Voltage: 75V; Temperature Coeffcient: 100ppm/C; Power: 1/10W; Populated: Yes; MCHP-ID: RSMT0138; Package: 0603; Revision: 2; Symbol: Resistor; Status: MCL Design; ComponentLink1URL: https://chn-vm-apps.microchip.com/mchprepo/parts/Datasheets/AOA0000CE2.pdf; ComponentLink1Description: SVN Datasheet; ComponentLink2URL: C:\ALTIUM_WORK\00001_MCHP-CDB\Datasheets\AOA0000CE2.pdf; ComponentLink2Description: Local Datasheet; ComponentLink3URL: C:\ALTIUM_WORK\00001_MCHP-CDB\Library\LibraryRefs\Resistor.SchLib; ComponentLink3Description: Open Symbol; ComponentLink4URL: C:\ALTIUM_WORK\00001_MCHP-CDB\Library\Footprints\RES_C_0603.PcbLib; ComponentLink4Description: Open Footprint; ComponentLink5Description: Open Footprint 2; ComponentLink6Description: Open Footprint 3; ComponentLink7Description: Open Footprint 4; Operating Temperature: -55C to +155C; Category: Resistor; Type: RES SMD; Composition: TKF; Manufacturer 2: Yageo; Manufacturer Part Number 2: RC0603FR-071KL; Manufacturer 3: ROHM; Manufacturer Part Number 3: MCR03EZPFX1001; Manufacturer 4: Stackpole Electronics Inc; Manufacturer Part Number 4: RMCF0603FT1K00; Manufacturer 5: Stackpole Electronics Inc; Manufacturer Part Number 5: RMCF 1/16 1K 1% R; Manufacturer 6: Vishay; Manufacturer Part Number 6: CRCW06031K00FKEA; Manufacturer 7: Stackpole Electronics Inc; Manufacturer Part Number 7: RMCF1/161.0K1%TR; Manufacturer 8: TE Connectivity; Manufacturer Part Number 8: 1622866-1; Supplier 1: Digi-Key; Supplier Part Number 1: P1.00KHCT-ND; Supplier 2: Digi-Key; Supplier Part Number 2: P1.00KHTR-ND; Supplier 3: Digi-Key; Supplier Part Number 3: 311-1.00KHRCT-ND; Supplier 4: Digi-Key; Supplier Part Number 4: RHM1.00KHCT-ND; Supplier 5: Digi-Key; Supplier Part Number 5: RMCF1/161KFRTR-ND; Supplier 6: Digi-Key; Supplier Part Number 6: RMCF0603FT1K00TR-ND; Supplier 7: Newark; Supplier Part Number 7: 52K8015; Supplier 8: Stackpole Electronics Inc; Supplier Part Number 8: RMCF1/161.0K1%TR; Supplier 9: Digi-Key; Supplier Part Number 9: A106049CT-ND; Quantity Override: 1
R60 R74 = RES2360: Manufacturer 1: Panasonic Electronic Components; Manufacturer Part Number 1: ERJ-3GEY0R00V; Description_: RES TKF 0R 1/10W SMD 0603 AEC-Q200; Dev Tools Status: Production; Circuit Type: Isolated; Power: 1/10W; Owner: Steve Dziaba; Populated: YES; Restricted Sourcing: No; MCHP-ID: RES2360; Package: 0603; Revision: 1; Symbol: Resistor; Status: MCL Design; ComponentLink1URL: https://chn-vm-apps.microchip.com/mchprepo/parts/Datasheets/ERJ-3GEY0R00V.pdf; ComponentLink1Description: SVN Datasheet; ComponentLink2URL: C:\ALTIUM_WORK\00001_MCHP-CDB\Datasheets\ERJ-3GEY0R00V.pdf; ComponentLink2Description: Local Datasheet; ComponentLink3URL: C:\ALTIUM_WORK\00001_MCHP-CDB\Library\LibraryRefs\Resistor.SchLib; ComponentLink3Description: Open Symbol; ComponentLink4URL: C:\ALTIUM_WORK\00001_MCHP-CDB\Library\Footprints\RES_C_0603.PcbLib; ComponentLink4Description: Open Footprint; ComponentLink5Description: Open Footprint 2; ComponentLink6Description: Open Footprint 3; ComponentLink7Description: Open Footprint 4; Category: Resistor; Type: RES SMD; Composition: TKF; Manufacturer 2: Vishay; Manufacturer Part Number 2: CRCW06030000Z0EB; Supplier 1: Digi-Key; Supplier Part Number 1: P0.0GCT-ND; Supplier 2: Digi-Key; Supplier Part Number 2: 541-2968-1-ND; Quantity Override: 1
R68 = RSMT1040: Manufacturer 1: Yageo; Manufacturer Part Number 1: RC0402JR-070RL; Description_: RES TKF 0R 1/16W SMD 0402; Dev Tools Status: Production; Power: 1/16W; Owner: Sompoch Loboonlert; MCHP-ID: RSMT1040; Revision: 2; Symbol: Resistor; Status: MCL Design; ComponentLink1URL: https://chn-vm-apps.microchip.com/mchprepo/parts/Datasheets/PYu-RC0402_51_RoHS_L_6.pdf; ComponentLink1Description: SVN Datasheet; ComponentLink2URL: C:\ALTIUM_WORK\00001_MCHP-CDB\Datasheets\PYu-RC0402_51_RoHS_L_6.pdf; ComponentLink2Description: Local Datasheet; ComponentLink3URL: C:\ALTIUM_WORK\00001_MCHP-CDB\Library\LibraryRefs\Resistor.SchLib; ComponentLink3Description: Open Symbol; ComponentLink4URL: C:\ALTIUM_WORK\00001_MCHP-CDB\Library\Footprints\RES_C_0402.PcbLib; ComponentLink4Description: Open Footprint; ComponentLink5Description: Open Footprint 2; ComponentLink6Description: Open Footprint 3; ComponentLink7Description: Open Footprint 4; Operating Temperature: -55C to +155C; Category: Resistor; Type: RES SMD; Composition: TKF; Supplier 1: Digi-Key; Supplier Part Number 1: 311-0.0JRCT-ND; Quantity Override: 1
TP1-TP3 = CON1754: Manufacturer 1: Keystone Electronics; Manufacturer Part Number 1: 5117; Description_: CON TP LOOP BLUE Ag TH; Dev Tools Status: Production; Owner: Sam Charles; Populated: YES; Restricted Sourcing: No; MCHP-ID: CON1754; Revision: 1; Symbol: Test Point; Status: MCL Design; ComponentLink1URL: https://chn-vm-apps.microchip.com/mchprepo/parts/Datasheets/5115-5119.PDF; ComponentLink1Description: SVN Datasheet; ComponentLink2URL: C:\ALTIUM_WORK\00001_MCHP-CDB\Datasheets\5115-5119.PDF; ComponentLink2Description: Local Datasheet; ComponentLink3URL: C:\ALTIUM_WORK\00001_MCHP-CDB\Library\LibraryRefs\Test Point.SchLib; ComponentLink3Description: Open Symbol; ComponentLink4URL: C:\ALTIUM_WORK\00001_MCHP-CDB\Library\Footprints\CON_TP_TH_V_BLUE_KEC_5117.PcbLib; ComponentLink4Description: Open Footprint; ComponentLink5Description: Open Footprint 2; ComponentLink6Description: Open Footprint 3; ComponentLink7Description: Open Footprint 4; Type: Test Point; Category: Connector; Supplier 1: Digi-Key; Supplier Part Number 1: 36-5117-ND; Quantity Override: 1; Assembly Type: TH
U1 = MIC9630: Manufacturer 1: Microchip Technology; Manufacturer Part Number 1: LAN8830/PSA; Description_: MCHP INTERFACE ETHERNET LAN8830 QFN-48; Dev Tools Status: Design; Owner: Sam Charles; Populated: YES; MCHP-ID: MIC9630; Symbol: LAN8830 QFN-48; Type: Ethernet; Status: MCL Design; Revision: 1; Category: MCHP-Interface; ComponentLink1URL: https://chn-vm-apps.microchip.com/mchprepo/parts/Datasheets/LAN8830 Prelimin Datasheet RevA; ComponentLink1Description: SVN Datasheet; ComponentLink2URL: C:\ALTIUM_WORK\00001_MCHP-CDB\Datasheets\LAN8830 Prelimin Datasheet RevA; ComponentLink2Description: Local Datasheet; ComponentLink3URL: C:\ALTIUM_WORK\00001_MCHP-CDB\Library\LibraryRefs\LAN8830 QFN-48.SchLib; ComponentLink3Description: Open Symbol; ComponentLink4URL: C:\ALTIUM_WORK\00001_MCHP-CDB\Library\Footprints\QFN-48_7x7_EP5.15x5.15.PcbLib; ComponentLink4Description: Open Footprint; ComponentLink5Description: Open Footprint 2; ComponentLink6Description: Open Footprint 3; ComponentLink7Description: Open Footprint 4; Supplier 1: Microchip Technology; Supplier Part Number 1: LAN8830/PSA; Operating Temperature: 0°C ~ 70°C; Quantity Override: 1; Legend Note: LAN8830
U2 = LAN8870 QFN-48: Manufacturer 1: Microchip Technology; Manufacturer Part Number 1: LAN8870-V/PUAVAO; MCHP-ID: MIC9579; Description_: MCHP INTERFACE LAN8870 1000BASE-T1 TRANSCEIVER; Dev Tools Status: Production; Owner: Sam Charles; Populated: YES; Revision: 1; ComponentLink1Description: SVN Datasheet; ComponentLink2Description: Local Datasheet; ComponentLink5Description: Open Footprint 2; ComponentLink6Description: Open Footprint 3; ComponentLink7Description: Open Footprint 4; Symbol: LAN8870 QFN-48; Type: Ethernet; Status: MCL Design; Category: MCHP-Interface; Supplier 1: Microchip Technology; Supplier Part Number 1: LAN8870-V/PUAVAO; Operating Temperature: -40C to +105C; Quantity Override: 1; BOM Notes: *; Legend Note: LAN8870
Y1 Y2 = MIC8987: Manufacturer 1: Microchip Technology; Manufacturer Part Number 1: VXM7-9013-25M0000000; Description_: MCHP CRYSTAL 25Mhz 10pF SMD L3.2W2.5H0.8; Dev Tools Status: Production; Value: 25Mhz; Owner: Sam Charles; Populated: YES; MCHP-ID: MIC8987; Revision: 1; Symbol: Crystal 4 Pins; Status: MCL Design; ComponentLink1URL: https://chn-vm-apps.microchip.com/mchprepo/parts/Datasheets/VXM7-9013-25M0000000.pdf; ComponentLink1Description: SVN Datasheet; ComponentLink2URL: C:\ALTIUM_WORK\00001_MCHP-CDB\Datasheets\VXM7-9013-25M0000000.pdf; ComponentLink2Description: Local Datasheet; ComponentLink3URL: C:\ALTIUM_WORK\00001_MCHP-CDB\Library\LibraryRefs\Crystal 4 Pins.SchLib; ComponentLink3Description: Open Symbol; ComponentLink4URL: C:\ALTIUM_WORK\00001_MCHP-CDB\Library\Footprints\CRYSTAL_L3.2W2.5H0.8.PcbLib; ComponentLink4Description: Open Footprint; ComponentLink5Description: Open Footprint 2; ComponentLink6Description: Open Footprint 3; ComponentLink7Description: Open Footprint 4; Category: MCHP-Clock/Timing; Type: Crystal; Supplier 1: Microchip Technology; Supplier Part Number 1: VXM7-9013-25M0000000; Quantity Override: 1; Operating Temperature: -40C to +85C